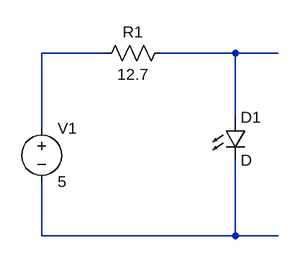
[diagram p0: schematic led_current_limiter.asc]
led_current_limiter.asc, the LTspice schematic file:
Version 4
SHEET 1 880 680
WIRE 192 192 96 192
WIRE 384 192 272 192
WIRE 448 192 384 192
WIRE 384 288 384 192
WIRE 96 304 96 192
WIRE 96 464 96 384
WIRE 384 464 384 352
WIRE 384 464 96 464
WIRE 448 464 384 464
SYMBOL voltage 96 288 R0
SYMATTR InstName V1
SYMATTR Value 5
SYMBOL LED 368 288 R0
SYMATTR InstName D1
SYMBOL res 288 176 R90
WINDOW 0 0 56 VBottom 2
WINDOW 3 32 56 VTop 2
SYMATTR InstName R1
SYMATTR Value 12.7

The netlist it stands for:
* led_current_limiter.asc
V1 N001 N003 5
D1 N002 N003 D
R1 N002 N001 12.7
.model D D
.lib standard.dio
.backanno
.end